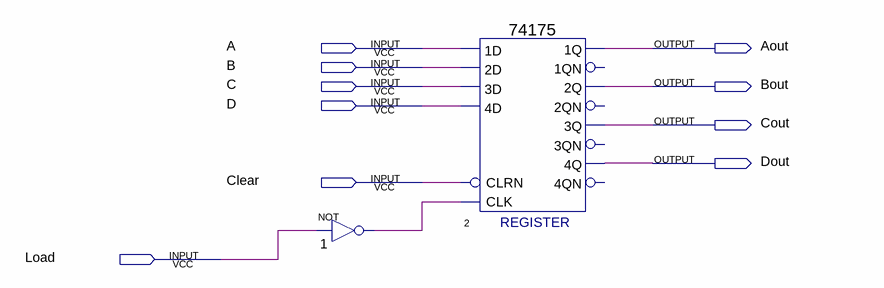
[diagram p0: schematic sheet]
// Quartus schematic 74175reg.bdf as structural Verilog: 2 symbols, 10 pins
module \74175reg  (
  input  A,
  input  B,
  input  C,
  input  D,
  input  Clear,
  input  Load,
  output Aout,
  output Bout,
  output Cout,
  output Dout
);

  wire n1_out;

  not u_1 (n1_out, Load);
  \74175  u_2 (
    .CLRN(Clear), .CLK(n1_out), .\3D (C), .\2D (B), .\1D (A), .\4D (D), .\1Q (Aout), .\3Q (Cout),
    .\2Q (Bout), .\4Q (Dout));  // open: 1QN, 2QN, 4QN, 3QN
endmodule
